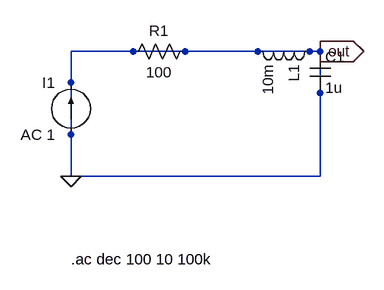
[diagram p0: schematic test_rlc_series.asc]
test_rlc_series.asc, the LTspice schematic file:
Version 4
SHEET 1 1800 680
WIRE 0 192 0 384
WIRE 0 192 128 192
WIRE 128 192 192 192
WIRE 192 192 288 192
WIRE 288 192 384 192
WIRE 384 192 384 256
WIRE 384 256 384 384
WIRE 384 384 0 384
FLAG 0 384 0
FLAG 384 192 out
IOPIN 384 192 Out
SYMBOL current 0 320 R180
WINDOW 0 24 80 Left 2
WINDOW 3 24 0 Left 2
SYMATTR InstName I1
SYMATTR Value AC 1
SYMBOL res 192 176 R90
WINDOW 0 0 56 VBottom 2
WINDOW 3 32 56 VTop 2
SYMATTR InstName R1
SYMATTR Value 100
SYMBOL ind 384 176 R90
SYMATTR InstName L1
SYMATTR Value 10m
SYMBOL cap 368 192 R0
SYMATTR InstName C1
SYMATTR Value 1u
TEXT 0 512 Left 2 !.ac dec 100 10 100k

The netlist it stands for:
* test_rlc_series.asc
I1 0 0 AC 1
R1 0 0 100
L1 0 0 10m
C1 0 0 1u
.ac dec 100 10 100k
.backanno
.end